# EAGLE design EsquematicoMicro (EAGLE 9.1.3)
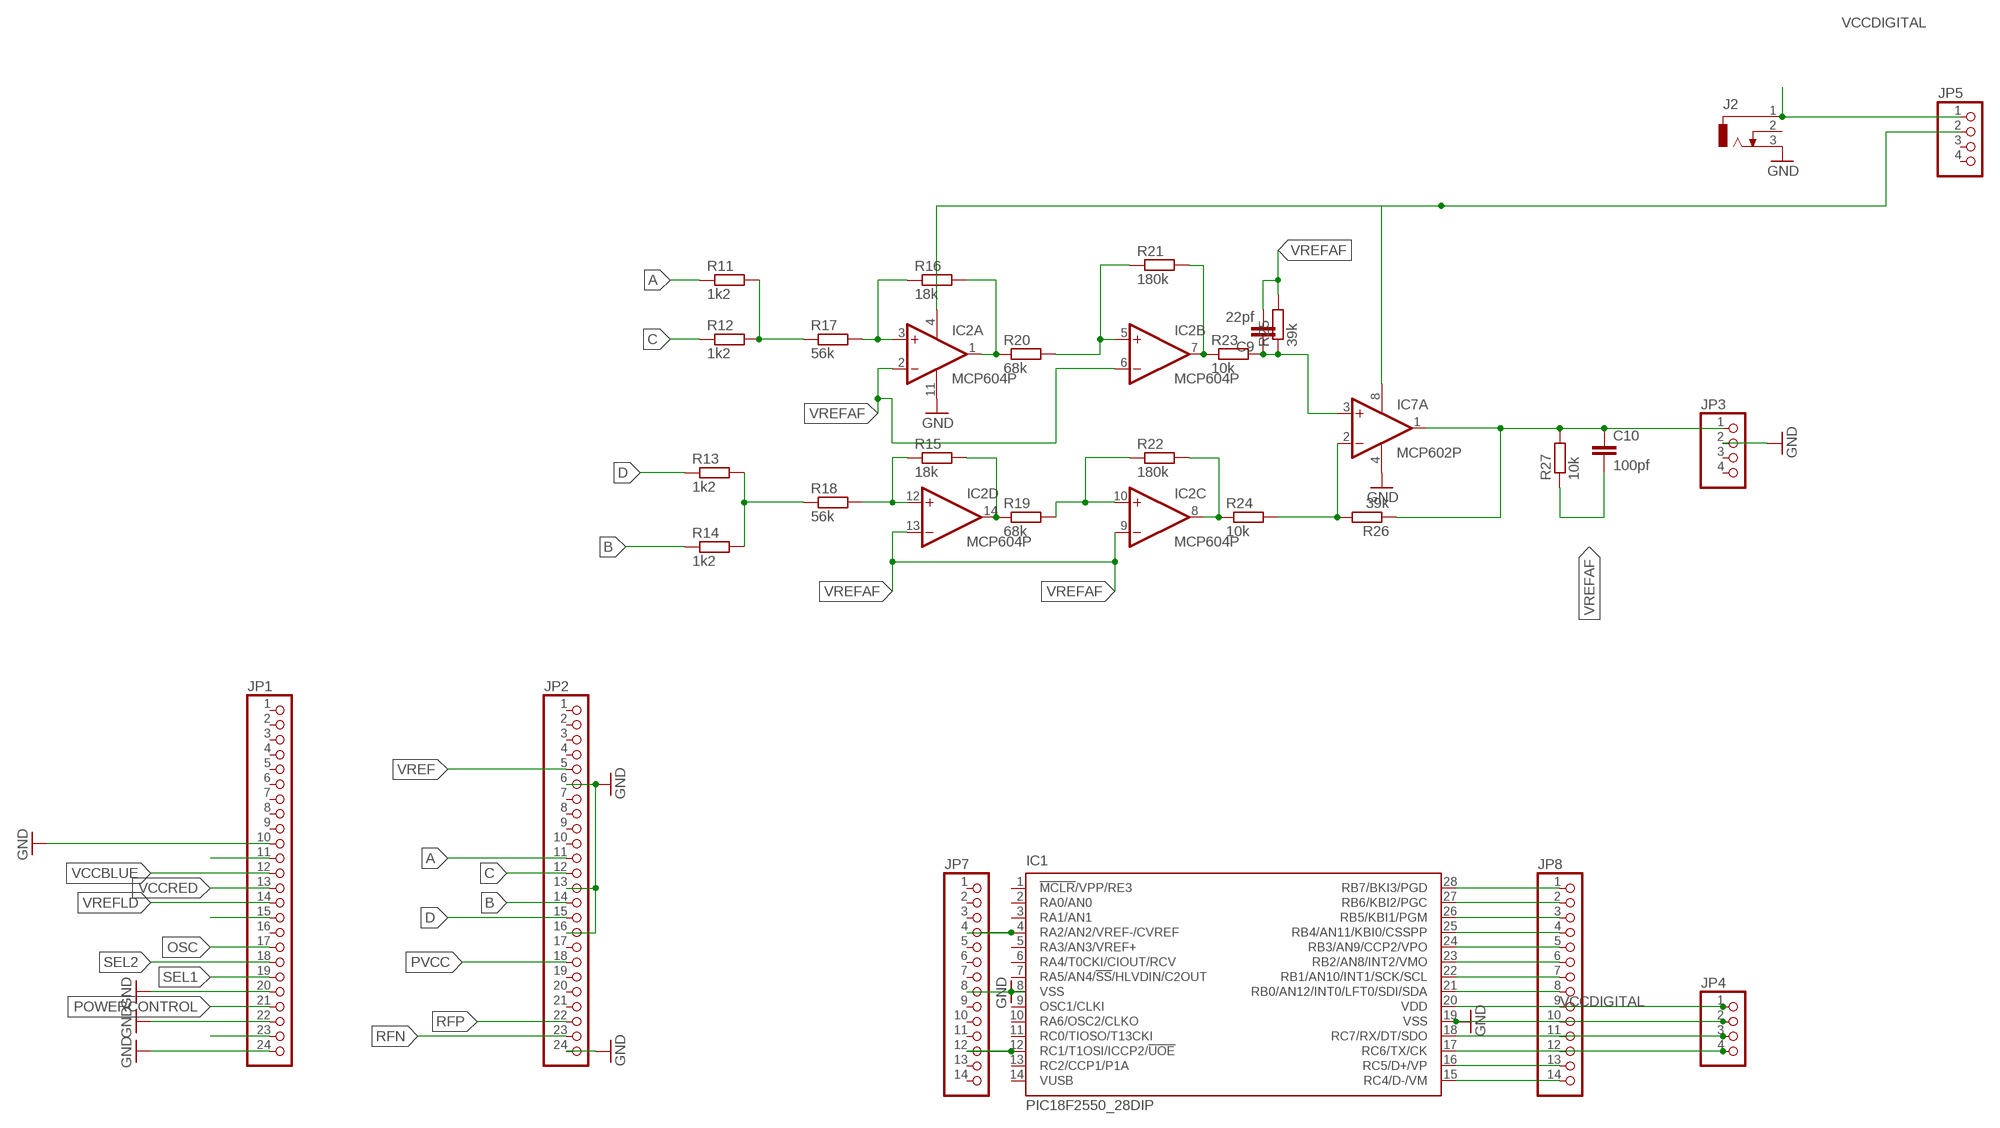
[diagram p0: schematic, sheet 1]

## Parts
C9  22pf  C-EU025-025X050  [C025-025X050]
C10  100pf  C-EU025-025X050  [C025-025X050]
IC1  PIC18F2550_28DIP  [DIL28-3]
IC2  MCP604P  [DIL14]
IC7  MCP602P  [DIL08]
J2  DCJ0303  [DCJ0303]
JP1  PINHD-1X24  [1X24]
JP2  PINHD-1X24  [1X24]
JP3  PINHD-1X4  [1X04]
JP4  PINHD-1X4  [1X04]
JP5  PINHD-1X4  [1X04]
JP7  PINHD-1X14  [1X14]
JP8  PINHD-1X14  [1X14]
R11  1k2  R-EU_0204/5  [0204/5]
R12  1k2  R-EU_0204/5  [0204/5]
R13  1k2  R-EU_0204/5  [0204/5]
R14  1k2  R-EU_0204/5  [0204/5]
R15  18k  R-EU_0204/5  [0204/5]
R16  18k  R-EU_0204/5  [0204/5]
R17  56k  R-EU_0204/5  [0204/5]
R18  56k  R-EU_0204/5  [0204/5]
R19  68k  R-EU_0204/5  [0204/5]
R20  68k  R-EU_0204/5  [0204/5]
R21  180k  R-EU_0204/5  [0204/5]
R22  180k  R-EU_0204/5  [0204/5]
R23  10k  R-EU_0204/5  [0204/5]
R24  10k  R-EU_0204/5  [0204/5]
R25  39k  R-EU_0204/5  [0204/5]
R26  39k  R-EU_0204/5  [0204/5]
R27  10k  R-EU_0204/5  [0204/5]

## Nets
A: JP2.11 R11.1
B: JP2.14 R14.1
C: JP2.12 R12.1
D: JP2.15 R13.1
GND: IC1.8(VSS) IC1.19(VSS) IC2.11(P:V-) IC7.4(P:V-) J2.3 JP1.10 JP1.20 JP1.22 JP1.24 JP2.6 JP2.13 JP2.16 JP2.24 JP3.2 JP4.2 JP7.8 JP8.10
LASERMICRO: IC1.4(RA2/AN2/VREF-/CVREF) JP7.4
N$1: JP1.11
N$2: IC1.18(RC7/RX/DT/SDO) JP4.3 JP8.11
N$3: IC1.17(RC6/TX/CK) JP4.4 JP8.12
N$4: IC1.28(RB7/BKI3/PGD) JP8.1
N$5: IC1.27(RB6/KBI2/PGC) JP8.2
N$6: JP1.15
N$7: IC1.25(RB4/AN11/KBI0/CSSPP) JP8.4
N$8: IC1.23(RB2/AN8/INT2/VMO) JP8.6
N$9: IC1.22(RB1/AN10/INT1/SCK/SCL) JP8.7
N$10: IC1.21(RB0/AN12/INT0/LFT0/SDI/SDA) JP8.8
N$11: IC1.16(RC5/D+/VP) JP8.13
N$12: IC1.15(RC4/D-/VM) JP8.14
N$13: IC1.26(RB5/KBI1/PGM) JP8.3
N$14: JP1.23
N$15: R11.2 R12.2 R17.1
N$16: R13.2 R14.2 R18.1
N$17: IC2.3(A:+IN) R16.1 R17.2
N$18: IC2.12(D:+IN) R15.1 R18.2
N$19: IC2.1(A:OUT) R16.2 R20.1
N$20: IC2.14(D:OUT) R15.2 R19.1
N$21: IC2.10(C:+IN) R19.2 R22.1
N$22: IC2.8(C:OUT) R22.2 R24.1
N$23: IC2.5(B:+IN) R20.2 R21.1
N$24: IC2.4(P:V+) IC7.8(P:V+) JP5.2
N$25: C9.1 IC7.3(A:+IN) R23.2 R25.1
N$26: IC7.2(A:-IN) R24.2 R26.2
N$27: C10.1 IC7.1(A:OUT) JP3.1 R26.1 R27.2
N$28: IC2.7(B:OUT) R21.2 R23.1
OSC: JP1.17
POWERCONTROL: JP1.21
PVCC: JP2.18
PWMTILT: IC1.24(RB3/AN9/CCP2/VPO) JP8.5
PWMY: IC1.12(RC1/T1OSI/ICCP2/!UOE) JP7.12
RFN: JP2.23
RFP: JP2.22
SEL1: JP1.19
SEL2: JP1.18
VCCBLUE: JP1.12
VCCDIGITAL: IC1.20(VDD) J2.1 JP4.1 JP5.1 JP8.9
VCCRED: JP1.13
VREF: JP2.5
VREFAF: C9.2 C10.2 IC2.2(A:-IN) IC2.6(B:-IN) IC2.9(C:-IN) IC2.13(D:-IN) R25.2 R27.1
VREFLD: JP1.14
Unconnected: IC1.1(!MCLR!/VPP/RE3) IC1.2(RA0/AN0) IC1.3(RA1/AN1) IC1.5(RA3/AN3/VREF+) IC1.6(RA4/T0CKI/CIOUT/RCV) IC1.7(RA5/AN4/!SS!/HLVDIN/C2OUT) IC1.9(OSC1/CLKI) IC1.10(RA6/OSC2/CLKO) IC1.11(RC0/TIOSO/T13CKI) IC1.13(RC2/CCP1/P1A) IC1.14(VUSB) IC7.5(B:+IN) IC7.6(B:-IN) IC7.7(B:OUT) J2.2 JP1.1 JP1.2 JP1.3 JP1.4 JP1.5 JP1.6 JP1.7 JP1.8 JP1.9 JP1.16 JP2.1 JP2.2 JP2.3 JP2.4 JP2.7 JP2.8 JP2.9 JP2.10 JP2.17 JP2.19 JP2.20 JP2.21 JP3.3 JP3.4 JP5.3 JP5.4 JP7.1 JP7.2 JP7.3 JP7.5 JP7.6 JP7.7 JP7.9 JP7.10 JP7.11 JP7.13 JP7.14

## Library data of the parts
C9 C10 = rcl:C-EU: CAPACITOR, European symbol; SPICEPREFIX: C
IC1 = microchip:PIC18F2*_28: USB Microcontrollers with nanoWatt Technology High-Performance, Enhanced Flash, 28/40/44-Pin, Source: http://ww1.microchip.com/downloads/en/devicedoc/39632c.pdf; MF: MICROCHIP; MPN: PIC18F2550-I/SP; OC_FARNELL: 1523822; OC_NEWARK: 80K6054
IC2 = linear:MCP604: Quad Op Amp 2.7V to 6.0V Single Supply CMOS Source: http://ww1.microchip.com/downloads/en/DeviceDoc/21314g.pdf
IC7 = linear:MCP602: Single Op Amp 2.7V to 6.0V Single Supply CMOS Source: http://ww1.microchip.com/downloads/en/DeviceDoc/21314g.pdf; SPICEPREFIX: I
J2 = con-jack:DCJ0303: DC POWER JACK Source: DCJ0303.pdf; OC_FARNELL: unknown; OC_NEWARK: unknown
JP1 JP2 = pinhead:PINHD-1X24: PIN HEADER
JP3-JP5 = pinhead:PINHD-1X4: PIN HEADER
JP7 JP8 = pinhead:PINHD-1X14: PIN HEADER
R11-R27 = rcl:R-EU_: RESISTOR, European symbol; SPICEPREFIX: R

## Board
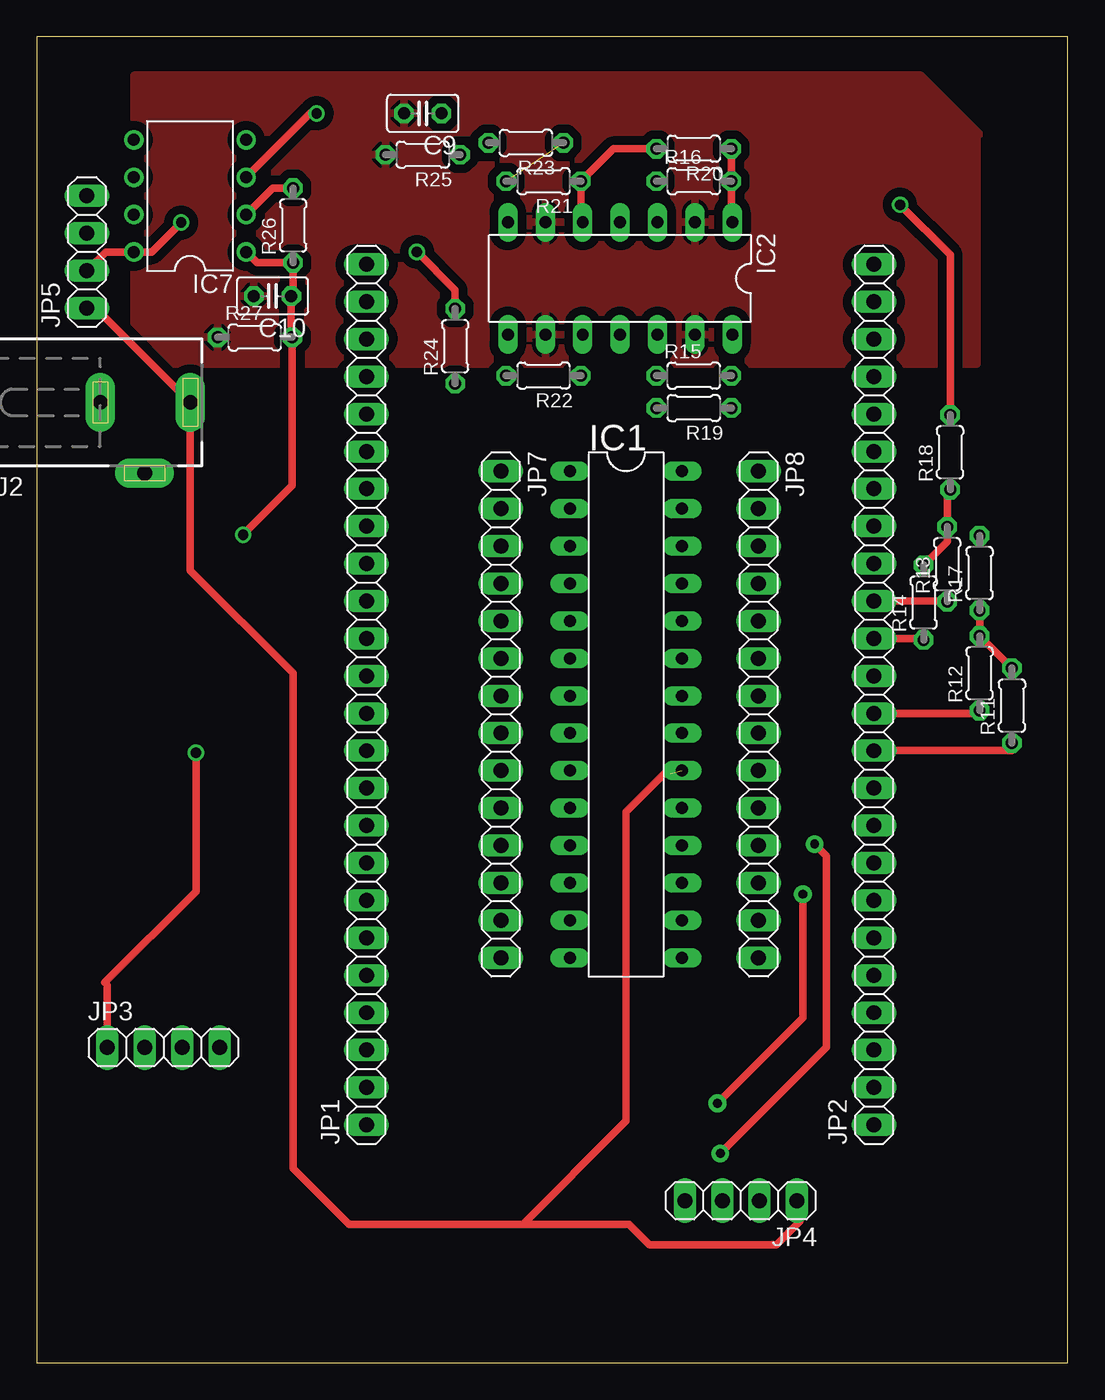
[diagram p1: board, top side]
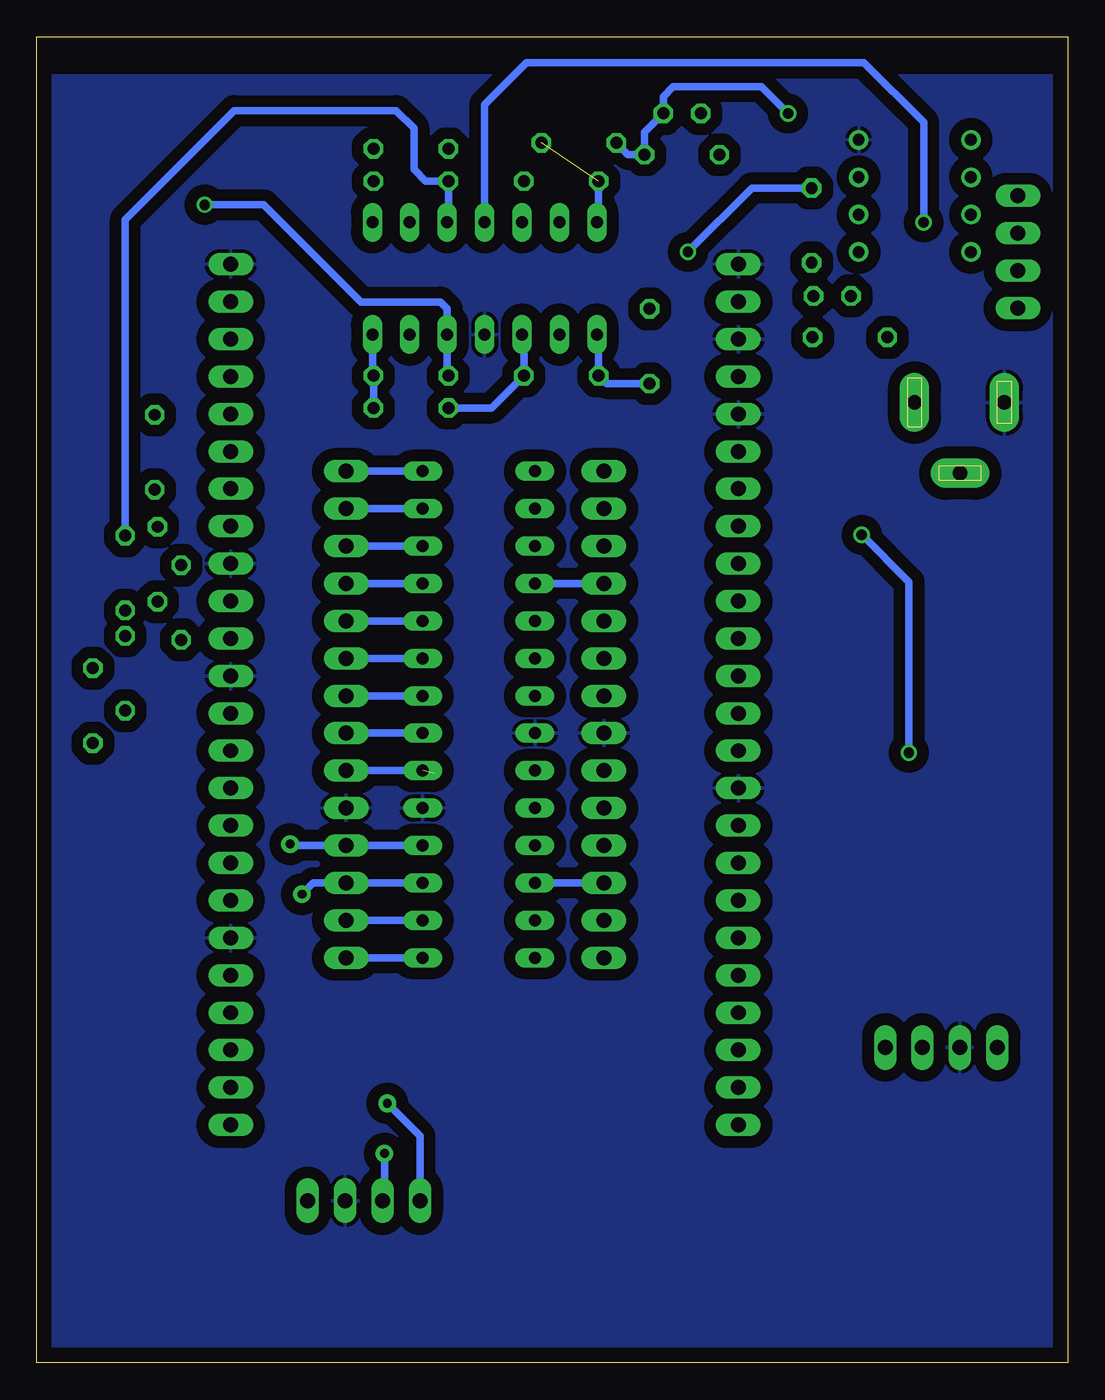
[diagram p2: board, bottom side, seen from below]

Size 70 x 90 mm. Coordinates in mm from the lower left corner, seen from the top.
Outline: 0,0 70,0 70,90 0,90 0,0
Copper layers (1*16): Top 0.035mm / dielectric 1.5mm / Bottom 0.035mm
Design rules "default *": minimum track width 0.5mm, minimum drill 0.5mm, track to track 6mil, track to pad 6mil, pad to pad 6mil, via to via 6mil, smd to smd 6mil, copper to edge 40mil, drill to drill 6mil, minimum pad ring 10mil, minimum via ring 8mil, stop-mask expansion 4mil, vias tented up to drill 0mil, thermal gap 10mil

### Footprints (pad centres in the part's own frame; a part is rotated, then mirrored left to right if it is on the bottom)
C025-025X050 = drill 0.813 octagon: 1 -1.27,0; 2 1.27,0
DIL28-3 = drill 0.813 long: 1 -16.51,-3.81; 2 -13.97,-3.81; 3 -11.43,-3.81; 4 -8.89,-3.81; 5 -6.35,-3.81; 6 -3.81,-3.81; 7 -1.27,-3.81; 8 1.27,-3.81; 9 3.81,-3.81; 10 6.35,-3.81; 11 8.89,-3.81; 12 11.43,-3.81; 13 13.97,-3.81; 14 16.51,-3.81; 15 16.51,3.81; 16 13.97,3.81; 17 11.43,3.81; 18 8.89,3.81; 19 6.35,3.81; 20 3.81,3.81; 21 1.27,3.81; 22 -1.27,3.81; 23 -3.81,3.81; 24 -6.35,3.81; 25 -8.89,3.81; 26 -11.43,3.81; 27 -13.97,3.81; 28 -16.51,3.81
DIL14 = drill 0.813 long: 1 -7.62,-3.81; 2 -5.08,-3.81; 3 -2.54,-3.81; 4 0,-3.81; 5 2.54,-3.81; 6 5.08,-3.81; 7 7.62,-3.81; 8 7.62,3.81; 9 5.08,3.81; 10 2.54,3.81; 11 0,3.81; 12 -2.54,3.81; 13 -5.08,3.81; 14 -7.62,3.81
DIL08 = drill 0.813 pad 1.27: 1 -3.81,-3.81; 2 -1.27,-3.81; 3 1.27,-3.81; 4 3.81,-3.81; 5 3.81,3.81; 6 1.27,3.81; 7 -1.27,3.81; 8 -3.81,3.81
DCJ0303 = drill 1 pad 2 long: 1 0,3.1; 2 4.8,0; 3 0,-3
1X24 = drill 1.016 long: 1 -29.21,0; 2 -26.67,0; 3 -24.13,0; 4 -21.59,0; 5 -19.05,0; 6 -16.51,0; 7 -13.97,0; 8 -11.43,0; 9 -8.89,0; 10 -6.35,0; 11 -3.81,0; 12 -1.27,0; 13 1.27,0; 14 3.81,0; 15 6.35,0; 16 8.89,0; 17 11.43,0; 18 13.97,0; 19 16.51,0; 20 19.05,0; 21 21.59,0; 22 24.13,0; 23 26.67,0; 24 29.21,0
1X04 = drill 1.016 long: 1 -3.81,0; 2 -1.27,0; 3 1.27,0; 4 3.81,0
1X14 = drill 1.016 long: 1 -16.51,0; 2 -13.97,0; 3 -11.43,0; 4 -8.89,0; 5 -6.35,0; 6 -3.81,0; 7 -1.27,0; 8 1.27,0; 9 3.81,0; 10 6.35,0; 11 8.89,0; 12 11.43,0; 13 13.97,0; 14 16.51,0
0204/5 = drill 0.813 octagon: 1 -2.54,0; 2 2.54,0

### Placement (x,y rotation side)
C9  26.2,84.8 180 top
C10  16,72.4 180 top
IC1  40,44 270 top
IC2  39.6,73.6 180 top
IC7  10.4,79.2 90 top
J2  7.32,65.19 270 top
JP1  22.38,45.35 90 top
JP2  56.83,45.35 90 top
JP3  8.6,21.4 0 top
JP4  47.8,11 180 top
JP5  3.4,75.4 90 top
JP7  31.5,44 270 top
JP8  49,44 270 top
R11  66.2,44.6 90 top
R12  64,46.8 90 top
R13  61.8,54.2 90 top
R14  60.2,51.6 90 top
R15  44.6,67 0 top
R16  44.6,80.2 0 top
R17  64,53.6 90 top
R18  62,61.8 90 top
R19  44.6,64.8 180 top
R20  44.6,82.4 180 top
R21  34.4,80.2 180 top
R22  34.4,67 180 top
R23  33.2,82.8 180 top
R24  28.4,69 90 top
R25  26.2,82 180 top
R26  17.4,77.2 90 top
R27  14.8,69.6 0 top

### Tracks (layer width: path | path; a pad name or v marks a point on that pad's centre or on a via)
A
  Top 0.5: JP2.11 66.2,41.54 R11.1
B
  Top 0.5: JP2.14 60.2,49.16 R14.1
C
  Top 0.5: JP2.12 64,44.08 R12.1
D
  Top 0.5: JP2.15 61.8,51.7 R13.1
GND
  pour Bottom (isolate 0.8): -0.64,87.38 70.27,87.38 70.27,0 -0.64,0
LASERMICRO
  Bottom 0.508: JP7.4 IC1.4
N$2  (via drill 0.6 pad 1.2)
  Top 0.508: v46.4,14.2 53.6,21.4 53.6,34.4 v52.8,35.2
  Bottom 0.508: IC1.18 JP8.11 52.71,35.11 v52.8,35.2 | v46.4,14.2 46.4,10.07 JP4.3
N$3  (via drill 0.6 pad 1.2)
  Top 0.508: v46.2,17.6 52,23.4 v52,31.8
  Bottom 0.508: IC1.17 JP8.12 51.23,32.57 v52,31.8 | JP4.4 43.99,15.39 v46.2,17.6
N$4
  Bottom 0.508: IC1.28 JP8.1
N$5
  Bottom 0.508: IC1.27 JP8.2
N$7
  Bottom 0.508: IC1.25 JP8.4
N$8
  Bottom 0.508: IC1.23 JP8.6
N$9
  Bottom 0.508: IC1.22 JP8.7
N$10
  Bottom 0.508: IC1.21 JP8.8
N$11
  Bottom 0.508: IC1.16 JP8.13
N$12
  Bottom 0.508: IC1.15 JP8.14
N$13
  Bottom 0.508: IC1.26 JP8.3
N$15
  Top 0.5: R11.2 R12.2 R17.1
N$16
  Top 0.5: R14.2 61.8,55.74 R13.2 61.8,59.06 R18.1
N$17
  Bottom 0.5: R17.2 64,77.6 56.6,85 45.6,85 44.4,83.8 44.4,81 43.6,80.2 R16.1 42.06,77.49 IC2.3
N$18  (via drill 0.7)
  Top 0.5: R18.2 62,75.2 v58.6,78.6
  Bottom 0.5: v58.6,78.6 54.6,78.6 48,72 42.6,72 42.14,71.54 IC2.12 42.14,67.08 R15.1
N$19
  Top 0.5: IC2.1 47.14,77.49 R16.2 R20.1
N$20
  Bottom 0.5: IC2.14 47.22,67.08 R15.2 R19.1
N$21
  Bottom 0.5: R19.2 39.14,64.8 R22.1 36.94,69.67 IC2.10
N$22
  Bottom 0.5: IC2.8 31.86,69.67 R22.2 31.32,66.46 R24.1
N$23
  Top 0.5: R20.2 39.14,82.4 R21.1 36.94,77.53 IC2.5
N$24  (via drill 0.7)
  Top 0.5: JP5.2 4.66,75.39 IC7.8 7.79,75.39 v9.8,77.4
  Bottom 0.5: v9.8,77.4 9.8,84.2 13.85,88.25 36.75,88.25 39.6,85.4 IC2.4
N$25  (via drill 0.7)
  Top 0.5: IC7.3 18.54,84.8 v19,84.8
  Bottom 0.5: v19,84.8 20.8,86.6 26.8,86.6 27.47,85.93 C9.1 28.74,83.53 R25.1 29.86,82 R23.2
N$26  (via drill 0.7)
  Top 0.5: v25.8,75.4 28.4,72.8 R24.2 | IC7.2 16.02,79.74 R26.2
  Bottom 0.5: R26.2 21.46,79.74 v25.8,75.4
N$27  (via drill 0.7)
  Top 0.5: IC7.1 14.94,74.66 R26.1 17.4,72.53 C10.1 17.27,69.67 R27.2 17.34,59.54 v14,56.2 | v10.8,41.4 10.8,32 4.6,25.8 4.79,25.61 JP3.1
  Bottom 0.5: v14,56.2 10.8,53 v10.8,41.4
N$28  (1 unrouted)
  Bottom 0.5: R21.2 31.86,77.53 IC2.7
PWMTILT
  Bottom 0.508: IC1.24 JP8.5
PWMY
  Bottom 0.508: JP7.12 IC1.12
VCCDIGITAL  (1 unrouted)
  Top 0.5: 32.2,9.4 21.2,9.4 17.4,13.2 17.4,46.8 10.42,53.78 J2.1 4.01,71.59 JP5.1 | 32.2,9.4 33,9.4 39.8,16.2 40,16.4 40,37.4 42.6,40 43,40 | 32.2,9.4 40.2,9.4 41.6,8 50.2,8 51.8,9.6 51.61,9.79 JP4.1
  Bottom 0.508: IC1.20 JP8.9
VREFAF
  pour Top (isolate 0.6): 6.6,87.4 60,87.4 64,83.4 63.8,83.4 63.8,67.8 6.6,67.8